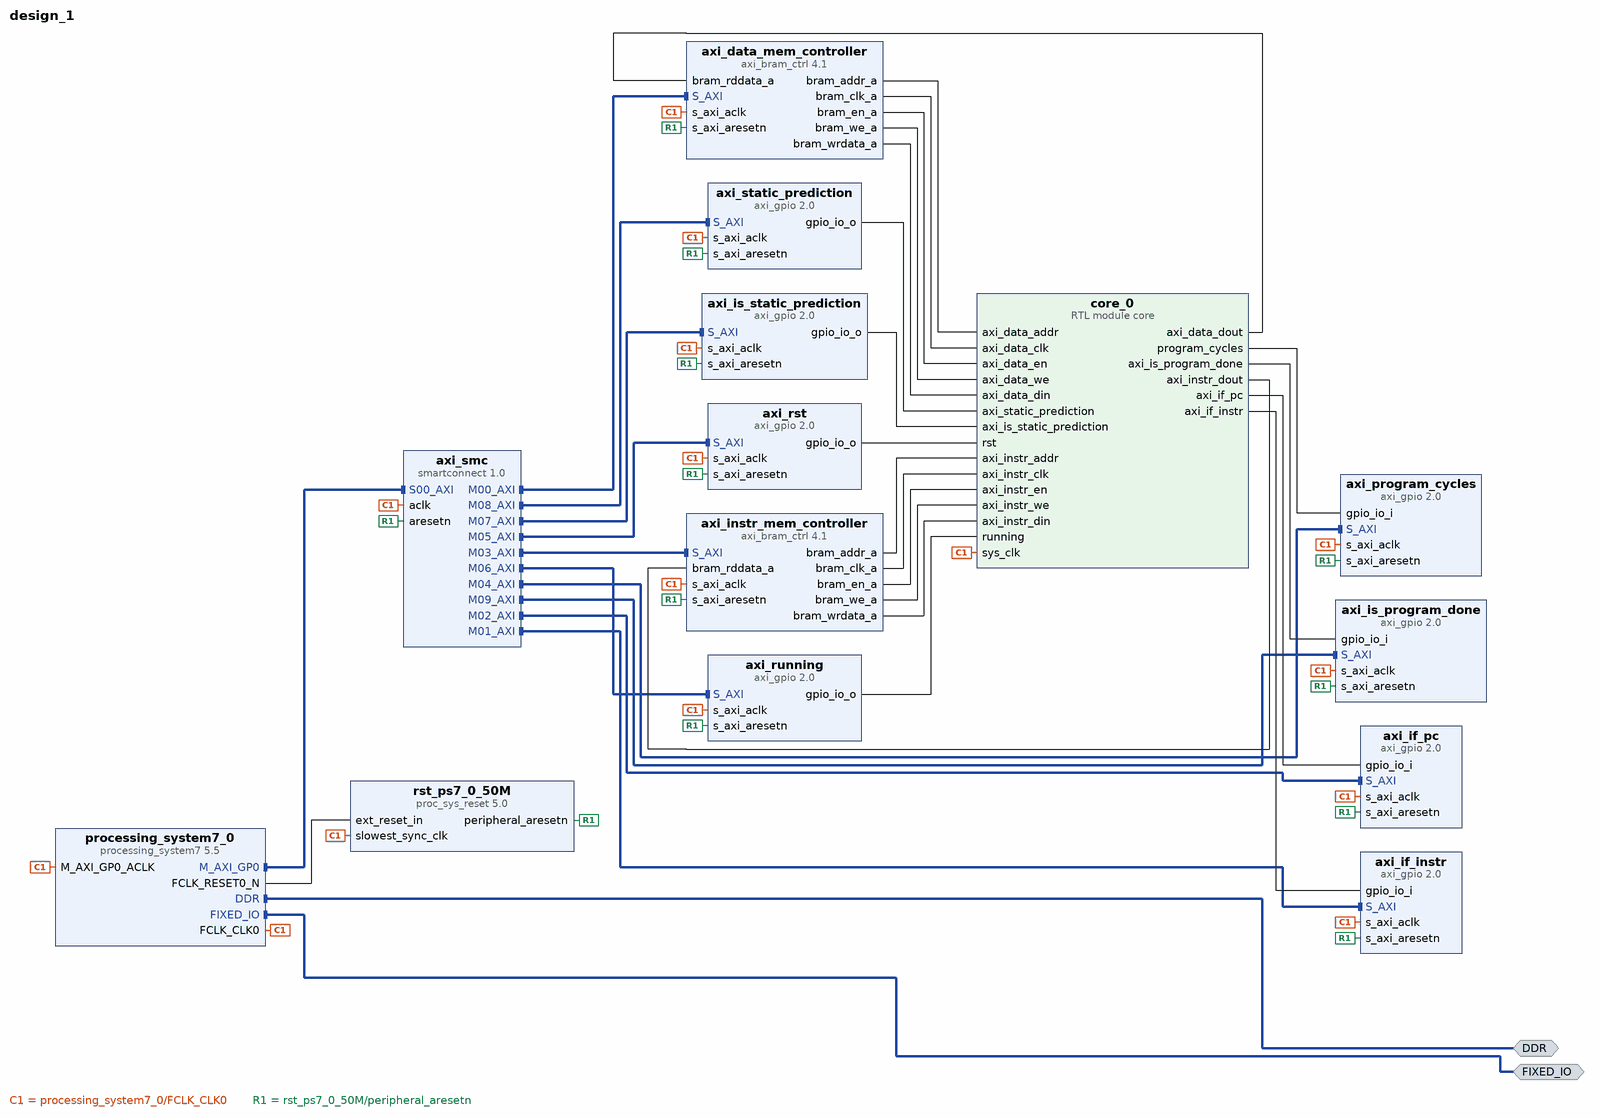
[diagram p0: block diagram of the top level]
# Vivado block design design_1, xc7z020clg400-1, Vivado 2025.1
create_bd_design design_1

create_bd_intf_port -mode Master -vlnv xilinx.com:interface:ddrx_rtl:1.0 DDR
create_bd_intf_port -mode Master -vlnv xilinx.com:display_processing_system7:fixedio_rtl:1.0 FIXED_IO

create_bd_cell -type ip -vlnv xilinx.com:ip:processing_system7:5.5 processing_system7_0
set_property -dict [list \
  CONFIG.PCW_APU_PERIPHERAL_FREQMHZ 650 \
  CONFIG.PCW_CRYSTAL_PERIPHERAL_FREQMHZ 50 \
  CONFIG.PCW_ENET0_ENET0_IO {MIO 16 .. 27} \
  CONFIG.PCW_ENET0_GRP_MDIO_ENABLE 1 \
  CONFIG.PCW_ENET0_GRP_MDIO_IO {MIO 52 .. 53} \
  CONFIG.PCW_ENET0_PERIPHERAL_ENABLE 1 \
  CONFIG.PCW_ENET0_RESET_ENABLE 1 \
  CONFIG.PCW_ENET0_RESET_IO {MIO 9} \
  CONFIG.PCW_ENET_RESET_ENABLE 1 \
  CONFIG.PCW_ENET_RESET_SELECT {Share reset pin} \
  CONFIG.PCW_FPGA0_PERIPHERAL_FREQMHZ 10 \
  CONFIG.PCW_FPGA1_PERIPHERAL_FREQMHZ 50 \
  CONFIG.PCW_GPIO_MIO_GPIO_ENABLE 1 \
  CONFIG.PCW_GPIO_MIO_GPIO_IO MIO \
  CONFIG.PCW_I2C_RESET_ENABLE 0 \
  CONFIG.PCW_M_AXI_GP0_FREQMHZ 10 \
  CONFIG.PCW_PERIPHERAL_BOARD_PRESET part0 \
  CONFIG.PCW_PRESET_BANK1_VOLTAGE {LVCMOS 1.8V} \
  CONFIG.PCW_QSPI_GRP_FBCLK_ENABLE 1 \
  CONFIG.PCW_QSPI_GRP_FBCLK_IO {MIO 8} \
  CONFIG.PCW_QSPI_GRP_SINGLE_SS_ENABLE 1 \
  CONFIG.PCW_QSPI_GRP_SINGLE_SS_IO {MIO 1 .. 6} \
  CONFIG.PCW_QSPI_PERIPHERAL_ENABLE 1 \
  CONFIG.PCW_QSPI_QSPI_IO {MIO 1 .. 6} \
  CONFIG.PCW_SD0_GRP_CD_ENABLE 1 \
  CONFIG.PCW_SD0_GRP_CD_IO {MIO 47} \
  CONFIG.PCW_SD0_GRP_WP_ENABLE 0 \
  CONFIG.PCW_SD0_PERIPHERAL_ENABLE 1 \
  CONFIG.PCW_SD0_SD0_IO {MIO 40 .. 45} \
  CONFIG.PCW_SDIO_PERIPHERAL_FREQMHZ 50 \
  CONFIG.PCW_SINGLE_QSPI_DATA_MODE x4 \
  CONFIG.PCW_UART0_PERIPHERAL_ENABLE 1 \
  CONFIG.PCW_UART0_UART0_IO {MIO 14 .. 15} \
  CONFIG.PCW_UART1_PERIPHERAL_ENABLE 0 \
  CONFIG.PCW_UART_PERIPHERAL_FREQMHZ 100 \
  CONFIG.PCW_UIPARAM_DDR_BUS_WIDTH {16 Bit} \
  CONFIG.PCW_UIPARAM_DDR_FREQ_MHZ 525 \
  CONFIG.PCW_UIPARAM_DDR_PARTNO {MT41J256M16 RE-125} \
  CONFIG.PCW_USB0_PERIPHERAL_ENABLE 0 \
  CONFIG.PCW_USB_RESET_ENABLE 1 \
] [get_bd_cells processing_system7_0]
# 479 more settings of processing_system7_0 are not shown: defaults, MIO pin electricals, DDR timing, and values the tool derives
create_bd_cell -type ip -vlnv xilinx.com:ip:axi_bram_ctrl:4.1 axi_data_mem_controller
set_property -dict {CONFIG.PROTOCOL AXI4 CONFIG.SINGLE_PORT_BRAM 1} [get_bd_cells axi_data_mem_controller]
create_bd_cell -type module -reference core core_0
create_bd_cell -type ip -vlnv xilinx.com:ip:proc_sys_reset:5.0 rst_ps7_0_50M
create_bd_cell -type ip -vlnv xilinx.com:ip:axi_gpio:2.0 axi_rst
set_property -dict {CONFIG.C_ALL_OUTPUTS 1 CONFIG.C_DOUT_DEFAULT 0x00000001 CONFIG.C_GPIO_WIDTH 1} [get_bd_cells axi_rst]
create_bd_cell -type ip -vlnv xilinx.com:ip:axi_gpio:2.0 axi_running
set_property -dict {CONFIG.C_ALL_OUTPUTS 1 CONFIG.C_GPIO_WIDTH 1} [get_bd_cells axi_running]
create_bd_cell -type ip -vlnv xilinx.com:ip:axi_gpio:2.0 axi_if_pc
set_property -dict {CONFIG.C_ALL_INPUTS 1} [get_bd_cells axi_if_pc]
create_bd_cell -type ip -vlnv xilinx.com:ip:axi_gpio:2.0 axi_if_instr
set_property -dict {CONFIG.C_ALL_INPUTS 1} [get_bd_cells axi_if_instr]
create_bd_cell -type ip -vlnv xilinx.com:ip:axi_bram_ctrl:4.1 axi_instr_mem_controller
set_property -dict {CONFIG.SINGLE_PORT_BRAM 1} [get_bd_cells axi_instr_mem_controller]
create_bd_cell -type ip -vlnv xilinx.com:ip:axi_gpio:2.0 axi_program_cycles
set_property -dict {CONFIG.C_ALL_INPUTS 1 CONFIG.C_GPIO_WIDTH 32} [get_bd_cells axi_program_cycles]
create_bd_cell -type ip -vlnv xilinx.com:ip:smartconnect:1.0 axi_smc
set_property -dict {CONFIG.NUM_MI 10 CONFIG.NUM_SI 1} [get_bd_cells axi_smc]
create_bd_cell -type ip -vlnv xilinx.com:ip:axi_gpio:2.0 axi_is_static_prediction
set_property -dict {CONFIG.C_ALL_INPUTS 0 CONFIG.C_ALL_OUTPUTS 1 CONFIG.C_GPIO_WIDTH 1} [get_bd_cells axi_is_static_prediction]
create_bd_cell -type ip -vlnv xilinx.com:ip:axi_gpio:2.0 axi_static_prediction
set_property -dict {CONFIG.C_ALL_OUTPUTS 1 CONFIG.C_GPIO_WIDTH 1} [get_bd_cells axi_static_prediction]
create_bd_cell -type ip -vlnv xilinx.com:ip:axi_gpio:2.0 axi_is_program_done
set_property -dict {CONFIG.C_ALL_INPUTS 1 CONFIG.C_GPIO_WIDTH 1} [get_bd_cells axi_is_program_done]

# ---- connections ----

connect_bd_intf_net [get_bd_intf_pins axi_smc/M00_AXI] [get_bd_intf_pins axi_data_mem_controller/S_AXI]
connect_bd_intf_net [get_bd_intf_pins axi_smc/M01_AXI] [get_bd_intf_pins axi_if_instr/S_AXI]
connect_bd_intf_net [get_bd_intf_pins axi_smc/M02_AXI] [get_bd_intf_pins axi_if_pc/S_AXI]
connect_bd_intf_net [get_bd_intf_pins axi_smc/M03_AXI] [get_bd_intf_pins axi_instr_mem_controller/S_AXI]
connect_bd_intf_net [get_bd_intf_pins axi_smc/M04_AXI] [get_bd_intf_pins axi_program_cycles/S_AXI]
connect_bd_intf_net [get_bd_intf_pins axi_smc/M05_AXI] [get_bd_intf_pins axi_rst/S_AXI]
connect_bd_intf_net [get_bd_intf_pins axi_smc/M06_AXI] [get_bd_intf_pins axi_running/S_AXI]
connect_bd_intf_net [get_bd_intf_pins axi_smc/M07_AXI] [get_bd_intf_pins axi_is_static_prediction/S_AXI]
connect_bd_intf_net [get_bd_intf_pins axi_smc/M08_AXI] [get_bd_intf_pins axi_static_prediction/S_AXI]
connect_bd_intf_net [get_bd_intf_pins axi_smc/M09_AXI] [get_bd_intf_pins axi_is_program_done/S_AXI]
connect_bd_intf_net [get_bd_intf_ports DDR] [get_bd_intf_pins processing_system7_0/DDR]
connect_bd_intf_net [get_bd_intf_ports FIXED_IO] [get_bd_intf_pins processing_system7_0/FIXED_IO]
connect_bd_intf_net [get_bd_intf_pins processing_system7_0/M_AXI_GP0] [get_bd_intf_pins axi_smc/S00_AXI]
connect_bd_net [get_bd_pins axi_data_mem_controller/bram_addr_a] [get_bd_pins core_0/axi_data_addr]
connect_bd_net [get_bd_pins axi_data_mem_controller/bram_clk_a] [get_bd_pins core_0/axi_data_clk]
connect_bd_net [get_bd_pins axi_data_mem_controller/bram_en_a] [get_bd_pins core_0/axi_data_en]
connect_bd_net [get_bd_pins axi_data_mem_controller/bram_we_a] [get_bd_pins core_0/axi_data_we]
connect_bd_net [get_bd_pins axi_data_mem_controller/bram_wrdata_a] [get_bd_pins core_0/axi_data_din]
connect_bd_net [get_bd_pins axi_instr_mem_controller/bram_addr_a] [get_bd_pins core_0/axi_instr_addr]
connect_bd_net [get_bd_pins axi_instr_mem_controller/bram_clk_a] [get_bd_pins core_0/axi_instr_clk]
connect_bd_net [get_bd_pins axi_instr_mem_controller/bram_en_a] [get_bd_pins core_0/axi_instr_en]
connect_bd_net [get_bd_pins axi_instr_mem_controller/bram_we_a] [get_bd_pins core_0/axi_instr_we]
connect_bd_net [get_bd_pins axi_instr_mem_controller/bram_wrdata_a] [get_bd_pins core_0/axi_instr_din]
connect_bd_net [get_bd_pins axi_is_static_prediction/gpio_io_o] [get_bd_pins core_0/axi_is_static_prediction]
connect_bd_net [get_bd_pins axi_rst/gpio_io_o] [get_bd_pins core_0/rst]
connect_bd_net [get_bd_pins axi_running/gpio_io_o] [get_bd_pins core_0/running]
connect_bd_net [get_bd_pins axi_static_prediction/gpio_io_o] [get_bd_pins core_0/axi_static_prediction]
connect_bd_net [get_bd_pins core_0/axi_data_dout] [get_bd_pins axi_data_mem_controller/bram_rddata_a]
connect_bd_net [get_bd_pins core_0/axi_if_instr] [get_bd_pins axi_if_instr/gpio_io_i]
connect_bd_net [get_bd_pins core_0/axi_if_pc] [get_bd_pins axi_if_pc/gpio_io_i]
connect_bd_net [get_bd_pins core_0/axi_instr_dout] [get_bd_pins axi_instr_mem_controller/bram_rddata_a]
connect_bd_net [get_bd_pins core_0/axi_is_program_done] [get_bd_pins axi_is_program_done/gpio_io_i]
connect_bd_net [get_bd_pins core_0/program_cycles] [get_bd_pins axi_program_cycles/gpio_io_i]
connect_bd_net [get_bd_pins processing_system7_0/FCLK_CLK0] \
  [get_bd_pins axi_data_mem_controller/s_axi_aclk] [get_bd_pins processing_system7_0/M_AXI_GP0_ACLK] \
  [get_bd_pins rst_ps7_0_50M/slowest_sync_clk] [get_bd_pins axi_rst/s_axi_aclk] [get_bd_pins axi_running/s_axi_aclk] \
  [get_bd_pins axi_if_pc/s_axi_aclk] [get_bd_pins axi_if_instr/s_axi_aclk] [get_bd_pins axi_instr_mem_controller/s_axi_aclk] \
  [get_bd_pins axi_program_cycles/s_axi_aclk] [get_bd_pins axi_smc/aclk] [get_bd_pins axi_is_static_prediction/s_axi_aclk] \
  [get_bd_pins axi_static_prediction/s_axi_aclk] [get_bd_pins axi_is_program_done/s_axi_aclk] [get_bd_pins core_0/sys_clk]
connect_bd_net [get_bd_pins processing_system7_0/FCLK_RESET0_N] [get_bd_pins rst_ps7_0_50M/ext_reset_in]
connect_bd_net [get_bd_pins rst_ps7_0_50M/peripheral_aresetn] \
  [get_bd_pins axi_data_mem_controller/s_axi_aresetn] [get_bd_pins axi_rst/s_axi_aresetn] \
  [get_bd_pins axi_running/s_axi_aresetn] [get_bd_pins axi_if_pc/s_axi_aresetn] [get_bd_pins axi_if_instr/s_axi_aresetn] \
  [get_bd_pins axi_instr_mem_controller/s_axi_aresetn] [get_bd_pins axi_program_cycles/s_axi_aresetn] \
  [get_bd_pins axi_smc/aresetn] [get_bd_pins axi_is_static_prediction/s_axi_aresetn] \
  [get_bd_pins axi_static_prediction/s_axi_aresetn] [get_bd_pins axi_is_program_done/s_axi_aresetn]

# ---- address map ----
assign_bd_address -offset 0x40000000 -range 8K -target_address_space [get_bd_addr_spaces processing_system7_0/Data] [get_bd_addr_segs axi_data_mem_controller/S_AXI/Mem0]
assign_bd_address -offset 0x41200000 -range 64K -target_address_space [get_bd_addr_spaces processing_system7_0/Data] [get_bd_addr_segs axi_rst/S_AXI/Reg]
assign_bd_address -offset 0x41210000 -range 64K -target_address_space [get_bd_addr_spaces processing_system7_0/Data] [get_bd_addr_segs axi_running/S_AXI/Reg]
assign_bd_address -offset 0x41220000 -range 64K -target_address_space [get_bd_addr_spaces processing_system7_0/Data] [get_bd_addr_segs axi_if_pc/S_AXI/Reg]
assign_bd_address -offset 0x41230000 -range 64K -target_address_space [get_bd_addr_spaces processing_system7_0/Data] [get_bd_addr_segs axi_if_instr/S_AXI/Reg]
assign_bd_address -offset 0x41240000 -range 64K -target_address_space [get_bd_addr_spaces processing_system7_0/Data] [get_bd_addr_segs axi_is_static_prediction/S_AXI/Reg]
assign_bd_address -offset 0x41250000 -range 64K -target_address_space [get_bd_addr_spaces processing_system7_0/Data] [get_bd_addr_segs axi_static_prediction/S_AXI/Reg]
assign_bd_address -offset 0x41260000 -range 64K -target_address_space [get_bd_addr_spaces processing_system7_0/Data] [get_bd_addr_segs axi_is_program_done/S_AXI/Reg]
assign_bd_address -offset 0x41290000 -range 64K -target_address_space [get_bd_addr_spaces processing_system7_0/Data] [get_bd_addr_segs axi_program_cycles/S_AXI/Reg]
assign_bd_address -offset 0x42000000 -range 8K -target_address_space [get_bd_addr_spaces processing_system7_0/Data] [get_bd_addr_segs axi_instr_mem_controller/S_AXI/Mem0]

validate_bd_design
save_bd_design
